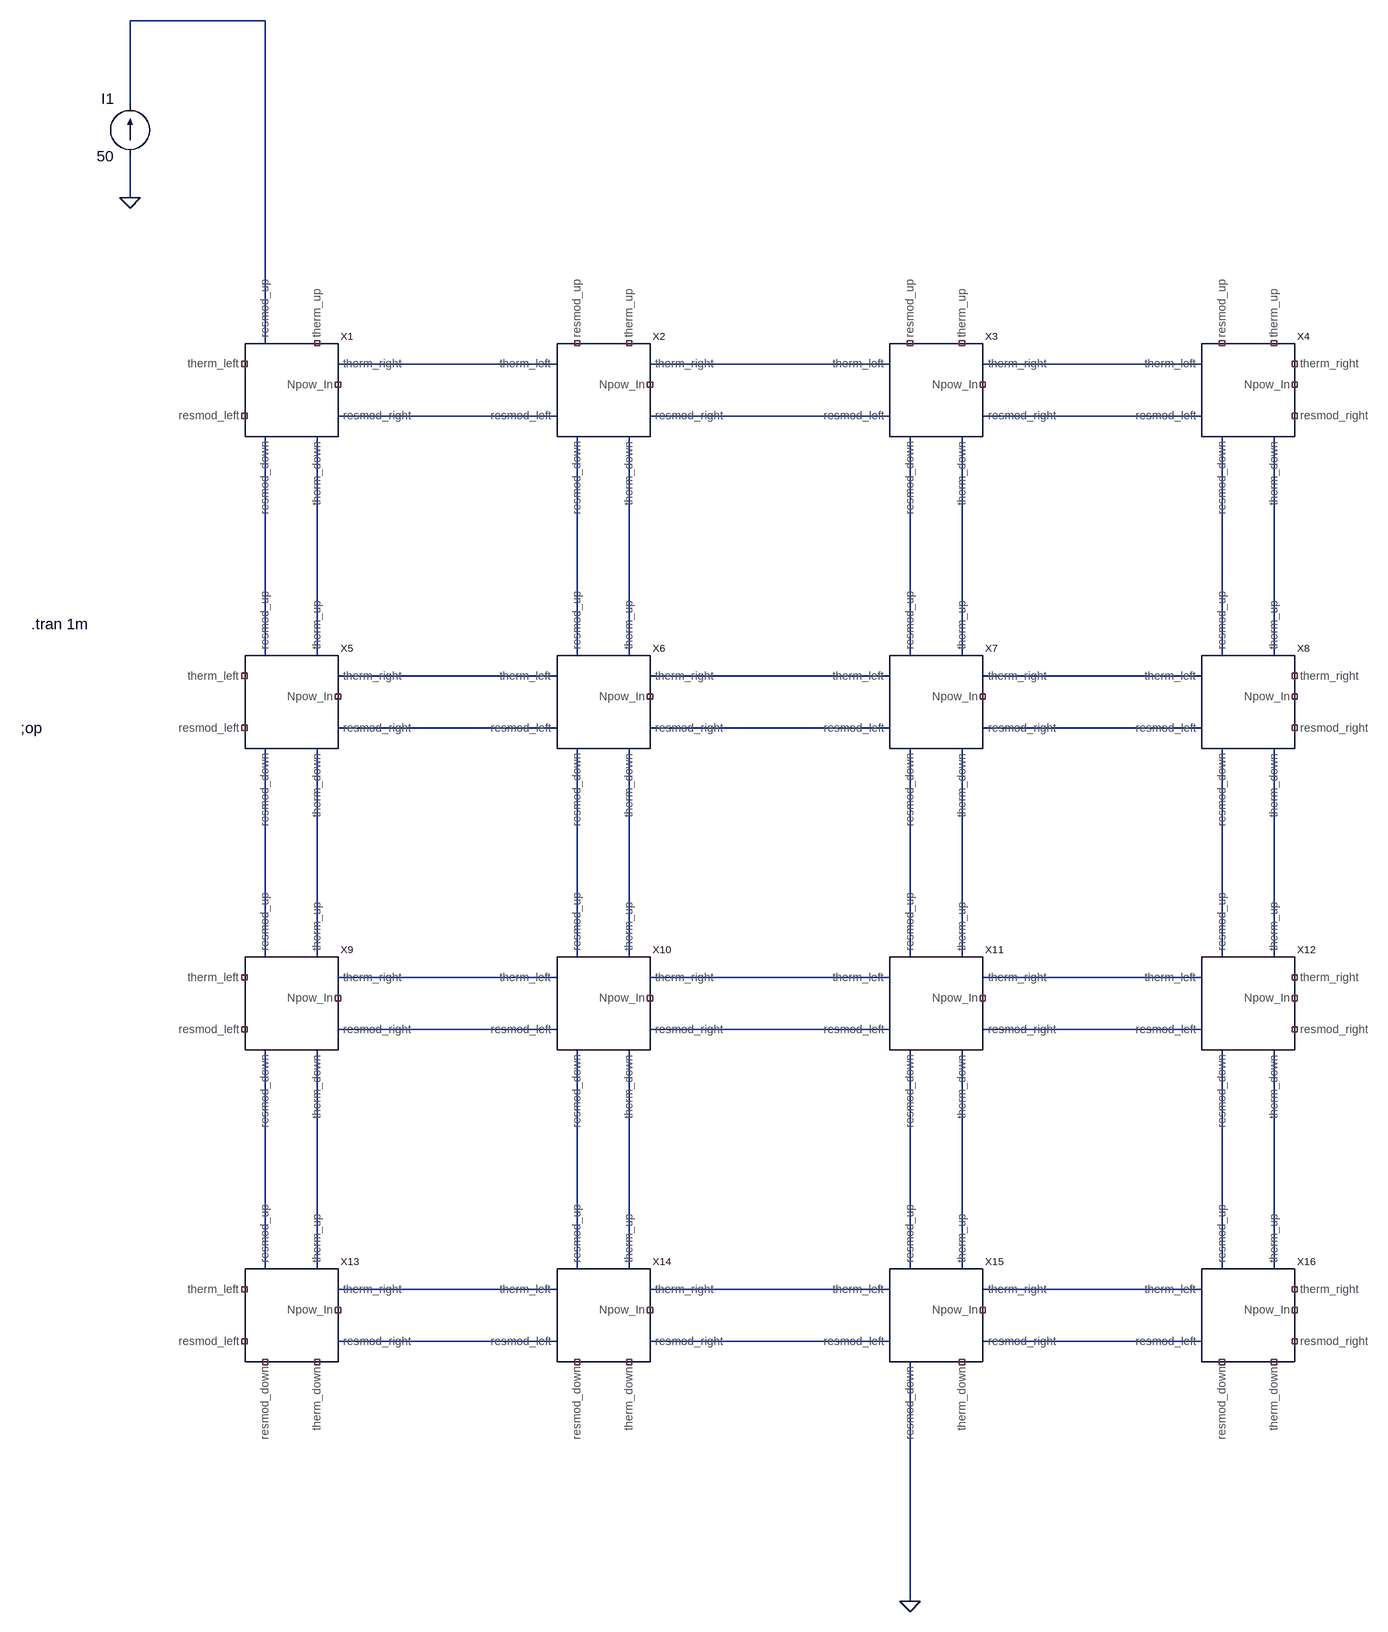
[diagram p0: schematic pcb test.asc]
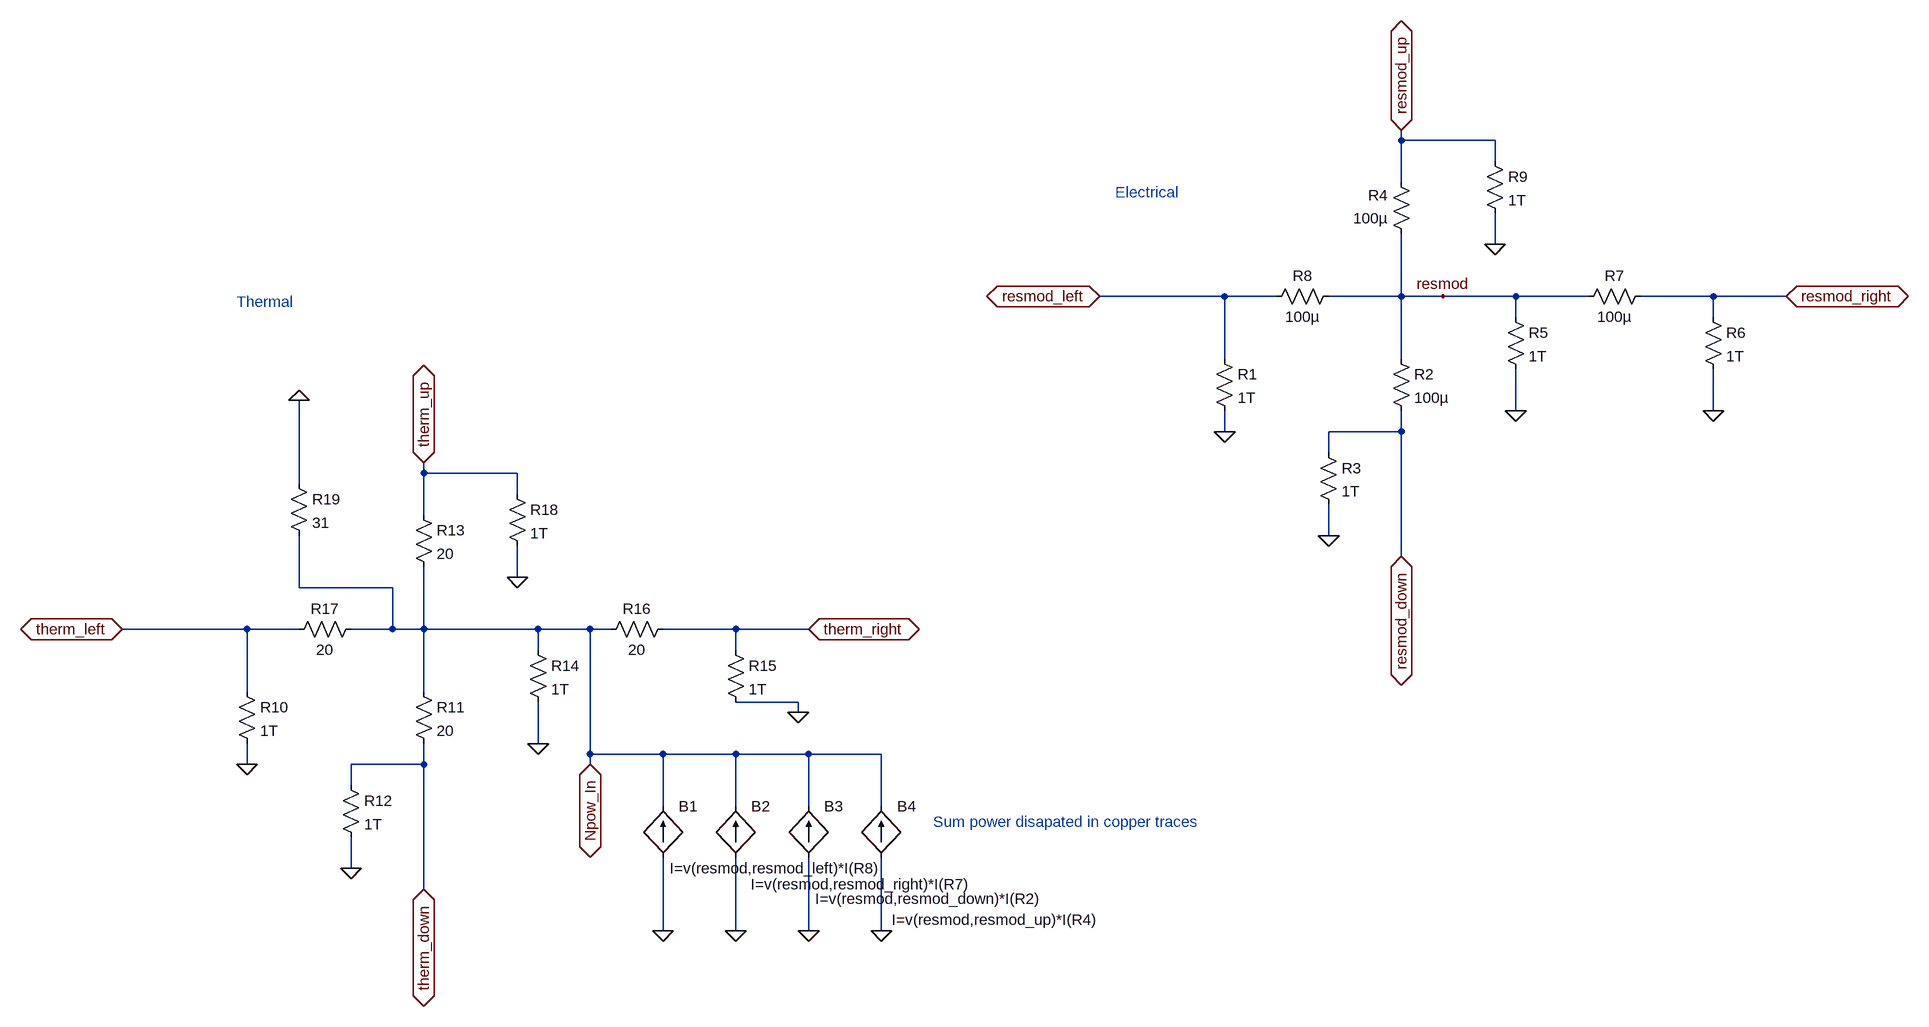
[diagram p1: sub-circuit pcb_1x1cm2_5oz.asc]
pcb test.asc, the LTspice schematic file:
Version 4
SHEET 1 2080 1988
WIRE -48 -464 -256 -464
WIRE -256 -336 -256 -464
WIRE -256 -192 -256 -256
WIRE -48 32 -48 -464
WIRE 400 64 64 64
WIRE 912 64 544 64
WIRE 1392 64 1056 64
WIRE 400 144 64 144
WIRE 912 144 544 144
WIRE 1392 144 1056 144
WIRE -48 512 -48 176
WIRE 32 512 32 176
WIRE 432 512 432 176
WIRE 512 512 512 176
WIRE 944 512 944 176
WIRE 1024 512 1024 176
WIRE 1424 512 1424 176
WIRE 1504 512 1504 176
WIRE 400 544 64 544
WIRE 912 544 544 544
WIRE 1392 544 1056 544
WIRE 400 624 64 624
WIRE 912 624 544 624
WIRE 1392 624 1056 624
WIRE -48 976 -48 656
WIRE 32 976 32 656
WIRE 432 976 432 656
WIRE 512 976 512 656
WIRE 944 976 944 656
WIRE 1024 976 1024 656
WIRE 1424 976 1424 656
WIRE 1504 976 1504 656
WIRE 400 1008 64 1008
WIRE 912 1008 544 1008
WIRE 1392 1008 1056 1008
WIRE 400 1088 64 1088
WIRE 912 1088 544 1088
WIRE 1392 1088 1056 1088
WIRE -48 1456 -48 1120
WIRE 32 1456 32 1120
WIRE 432 1456 432 1120
WIRE 512 1456 512 1120
WIRE 944 1456 944 1120
WIRE 1024 1456 1024 1120
WIRE 1424 1456 1424 1120
WIRE 1504 1456 1504 1120
WIRE 400 1488 64 1488
WIRE 912 1488 544 1488
WIRE 1392 1488 1056 1488
WIRE 400 1568 64 1568
WIRE 912 1568 544 1568
WIRE 1392 1568 1056 1568
WIRE 944 1968 944 1600
FLAG -256 -192 0
FLAG 944 1968 0
SYMBOL pcb_1x1cm2_5oz -64 128 R0
SYMATTR InstName X1
SYMBOL pcb_1x1cm2_5oz 416 128 R0
SYMATTR InstName X2
SYMBOL pcb_1x1cm2_5oz 928 128 R0
SYMATTR InstName X3
SYMBOL pcb_1x1cm2_5oz 1408 128 R0
SYMATTR InstName X4
SYMBOL pcb_1x1cm2_5oz -64 608 R0
SYMATTR InstName X5
SYMBOL pcb_1x1cm2_5oz 416 608 R0
SYMATTR InstName X6
SYMBOL pcb_1x1cm2_5oz 928 608 R0
SYMATTR InstName X7
SYMBOL pcb_1x1cm2_5oz 1408 608 R0
SYMATTR InstName X8
SYMBOL pcb_1x1cm2_5oz -64 1072 R0
SYMATTR InstName X9
SYMBOL pcb_1x1cm2_5oz 416 1072 R0
SYMATTR InstName X10
SYMBOL pcb_1x1cm2_5oz 928 1072 R0
SYMATTR InstName X11
SYMBOL pcb_1x1cm2_5oz 1408 1072 R0
SYMATTR InstName X12
SYMBOL pcb_1x1cm2_5oz -64 1552 R0
SYMATTR InstName X13
SYMBOL pcb_1x1cm2_5oz 416 1552 R0
SYMATTR InstName X14
SYMBOL pcb_1x1cm2_5oz 928 1552 R0
SYMATTR InstName X15
SYMBOL pcb_1x1cm2_5oz 1408 1552 R0
SYMATTR InstName X16
SYMBOL current -256 -256 R180
WINDOW 0 24 88 Left 0
WINDOW 3 24 0 Left 0
WINDOW 123 0 0 Left 0
WINDOW 39 0 0 Left 0
SYMATTR InstName I1
SYMATTR Value 50
TEXT -424 624 Left 0 !;op
TEXT -408 464 Left 0 !.tran 1m

pcb_1x1cm2_5oz.asc, the sub-circuit schematic file:
Version 4
SHEET 1 1224 1204
WIRE 416 -176 416 -192
WIRE 560 -176 416 -176
WIRE 560 -144 560 -176
WIRE 416 -112 416 -176
WIRE 560 -16 560 -64
WIRE 144 64 -48 64
WIRE 224 64 144 64
WIRE 416 64 416 -32
WIRE 416 64 304 64
WIRE 480 64 416 64
WIRE 592 64 480 64
WIRE 704 64 592 64
WIRE 896 64 784 64
WIRE 1008 64 896 64
WIRE 592 96 592 64
WIRE 896 96 896 64
WIRE 144 160 144 64
WIRE 416 160 416 64
WIRE 592 240 592 176
WIRE 896 240 896 176
WIRE 144 272 144 240
WIRE 416 272 416 240
WIRE 416 272 304 272
WIRE 304 304 304 272
WIRE -1088 336 -1088 320
WIRE -944 336 -1088 336
WIRE -1280 352 -1280 224
WIRE -944 368 -944 336
WIRE -1088 400 -1088 336
WIRE 304 432 304 384
WIRE 416 464 416 272
WIRE -944 496 -944 448
WIRE -1280 512 -1280 432
WIRE -1136 512 -1280 512
WIRE -1360 576 -1552 576
WIRE -1280 576 -1360 576
WIRE -1136 576 -1136 512
WIRE -1136 576 -1200 576
WIRE -1088 576 -1088 480
WIRE -1088 576 -1136 576
WIRE -912 576 -1088 576
WIRE -832 576 -912 576
WIRE -800 576 -832 576
WIRE -608 576 -720 576
WIRE -496 576 -608 576
WIRE -912 608 -912 576
WIRE -608 608 -608 576
WIRE -1360 672 -1360 576
WIRE -1088 672 -1088 576
WIRE -512 688 -608 688
WIRE -512 704 -512 688
WIRE -912 752 -912 688
WIRE -832 768 -832 576
WIRE -720 768 -832 768
WIRE -608 768 -720 768
WIRE -496 768 -608 768
WIRE -384 768 -496 768
WIRE -1360 784 -1360 752
WIRE -1088 784 -1088 752
WIRE -1088 784 -1200 784
WIRE -832 784 -832 768
WIRE -1200 816 -1200 784
WIRE -720 848 -720 768
WIRE -608 848 -608 768
WIRE -496 848 -496 768
WIRE -384 848 -384 768
WIRE -1200 944 -1200 896
WIRE -1088 976 -1088 784
WIRE -720 1040 -720 928
WIRE -608 1040 -608 928
WIRE -496 1040 -496 928
WIRE -384 1040 -384 928
FLAG 304 432 0
FLAG 144 272 0
FLAG 592 240 0
FLAG 896 240 0
FLAG -48 64 resmod_left
IOPIN -48 64 BiDir
FLAG 416 -192 resmod_up
IOPIN 416 -192 BiDir
FLAG 416 464 resmod_down
IOPIN 416 464 BiDir
FLAG 1008 64 resmod_right
IOPIN 1008 64 BiDir
FLAG 480 64 resmod
FLAG 560 -16 0
FLAG -1200 944 0
FLAG -1360 784 0
FLAG -912 752 0
FLAG -512 704 0
FLAG -1552 576 therm_left
IOPIN -1552 576 BiDir
FLAG -1088 320 therm_up
IOPIN -1088 320 BiDir
FLAG -1088 976 therm_down
IOPIN -1088 976 BiDir
FLAG -496 576 therm_right
IOPIN -496 576 BiDir
FLAG -944 496 0
FLAG -1280 224 0
FLAG -832 784 Npow_In
IOPIN -832 784 BiDir
FLAG -720 1040 0
FLAG -608 1040 0
FLAG -496 1040 0
FLAG -384 1040 0
SYMBOL res 128 144 R0
SYMATTR InstName R1
SYMATTR Value 1T
SYMBOL res 400 144 R0
SYMATTR InstName R2
SYMATTR Value 100µ
SYMBOL res 288 288 R0
SYMATTR InstName R3
SYMATTR Value 1T
SYMBOL res 432 -16 R180
WINDOW 0 36 76 Left 0
WINDOW 3 36 40 Left 0
SYMATTR InstName R4
SYMATTR Value 100µ
SYMBOL res 576 80 R0
SYMATTR InstName R5
SYMATTR Value 1T
SYMBOL res 880 80 R0
SYMATTR InstName R6
SYMATTR Value 1T
SYMBOL res 688 80 R270
WINDOW 0 32 56 VTop 0
WINDOW 3 0 56 VBottom 0
SYMATTR InstName R7
SYMATTR Value 100µ
SYMBOL res 320 48 R90
WINDOW 0 0 56 VBottom 0
WINDOW 3 32 56 VTop 0
SYMATTR InstName R8
SYMATTR Value 100µ
SYMBOL res 544 -160 R0
SYMATTR InstName R9
SYMATTR Value 1T
SYMBOL res -1376 656 R0
SYMATTR InstName R10
SYMATTR Value 1T
SYMBOL res -1104 656 R0
SYMATTR InstName R11
SYMATTR Value 20
SYMBOL res -1216 800 R0
SYMATTR InstName R12
SYMATTR Value 1T
SYMBOL res -1104 384 R0
SYMATTR InstName R13
SYMATTR Value 20
SYMBOL res -928 592 R0
SYMATTR InstName R14
SYMATTR Value 1T
SYMBOL res -624 592 R0
SYMATTR InstName R15
SYMATTR Value 1T
SYMBOL res -704 560 R90
WINDOW 0 0 56 VBottom 0
WINDOW 3 32 56 VTop 0
SYMATTR InstName R16
SYMATTR Value 20
SYMBOL res -1184 560 R90
WINDOW 0 0 56 VBottom 0
WINDOW 3 32 56 VTop 0
SYMATTR InstName R17
SYMATTR Value 20
SYMBOL res -960 352 R0
SYMATTR InstName R18
SYMATTR Value 1T
SYMBOL res -1296 336 R0
SYMATTR InstName R19
SYMATTR Value 31
SYMBOL bi2 -720 848 R0
WINDOW 3 10 96 Left 0
SYMATTR Value I=v(resmod,resmod_left)*I(R8)
SYMATTR InstName B1
SYMBOL bi2 -608 848 R0
WINDOW 3 23 120 Left 0
SYMATTR Value I=v(resmod,resmod_right)*I(R7)
SYMATTR InstName B2
SYMBOL bi2 -496 848 R0
WINDOW 3 10 143 Left 0
SYMATTR Value I=v(resmod,resmod_down)*I(R2)
SYMATTR InstName B3
SYMBOL bi2 -384 848 R0
WINDOW 3 16 175 Left 0
SYMATTR Value I=v(resmod,resmod_up)*I(R4)
SYMATTR InstName B4
TEXT -304 872 Left 0 ;Sum power disapated in copper traces
TEXT -1376 72 Left 0 ;Thermal
TEXT -24 -96 Left 0 ;Electrical

The netlist it stands for:
* pcb test.asc
XX1 NC_01 N008 N005 N001 NC_02 N002 NC_03 N009 NC_04 pcb_1x1cm2_5oz
XX2 N005 N010 N006 NC_05 N002 N003 NC_06 N011 NC_07 pcb_1x1cm2_5oz
XX3 N006 N012 N007 NC_08 N003 N004 NC_09 N013 NC_10 pcb_1x1cm2_5oz
XX4 N007 N014 NC_11 NC_12 N004 NC_13 NC_14 N015 NC_15 pcb_1x1cm2_5oz
XX5 NC_16 N022 N019 N008 NC_17 N016 N009 N023 NC_18 pcb_1x1cm2_5oz
XX6 N019 N024 N020 N010 N016 N017 N011 N025 NC_19 pcb_1x1cm2_5oz
XX7 N020 N026 N021 N012 N017 N018 N013 N027 NC_20 pcb_1x1cm2_5oz
XX8 N021 N028 NC_21 N014 N018 NC_22 N015 N029 NC_23 pcb_1x1cm2_5oz
XX9 NC_24 N036 N033 N022 NC_25 N030 N023 N037 NC_26 pcb_1x1cm2_5oz
XX10 N033 N038 N034 N024 N030 N031 N025 N039 NC_27 pcb_1x1cm2_5oz
XX11 N034 N040 N035 N026 N031 N032 N027 N041 NC_28 pcb_1x1cm2_5oz
XX12 N035 N042 NC_29 N028 N032 NC_30 N029 N043 NC_31 pcb_1x1cm2_5oz
XX13 NC_32 NC_33 N047 N036 NC_34 N044 N037 NC_35 NC_36 pcb_1x1cm2_5oz
XX14 N047 NC_37 N048 N038 N044 N045 N039 NC_38 NC_39 pcb_1x1cm2_5oz
XX15 N048 0 N049 N040 N045 N046 N041 NC_40 NC_41 pcb_1x1cm2_5oz
XX16 N049 NC_42 NC_43 N042 N046 NC_44 N043 NC_45 NC_46 pcb_1x1cm2_5oz
I1 0 N001 50

* block symbol definitions
.subckt pcb_1x1cm2_5oz resmod_left resmod_down resmod_right resmod_up therm_left therm_right therm_up therm_down Npow_In
R1 resmod_left 0 1T
R2 resmod resmod_down 100µ
R3 resmod_down 0 1T
R4 resmod resmod_up 100µ
R5 resmod 0 1T
R6 resmod_right 0 1T
R7 resmod resmod_right 100µ
R8 resmod resmod_left 100µ
R9 resmod_up 0 1T
R10 therm_left 0 1T
R11 Npow_In therm_down 20
R12 therm_down 0 1T
R13 therm_up Npow_In 20
R14 Npow_In 0 1T
R15 therm_right 0 1T
R16 therm_right Npow_In 20
R17 Npow_In therm_left 20
R18 therm_up 0 1T
R19 0 Npow_In 31
B1 0 Npow_In I=v(resmod,resmod_left)*I(R8)
B2 0 Npow_In I=v(resmod,resmod_right)*I(R7)
B3 0 Npow_In I=v(resmod,resmod_down)*I(R2)
B4 0 Npow_In I=v(resmod,resmod_up)*I(R4)
* Sum power disapated in copper traces
* Thermal
* Electrical
.ends pcb_1x1cm2_5oz

;op
.tran 1m
.backanno
.end